# Altium schematic sheet main.SchDoc
size 127 x 101 mm; SheetNumber: 1; SheetTotal: 9
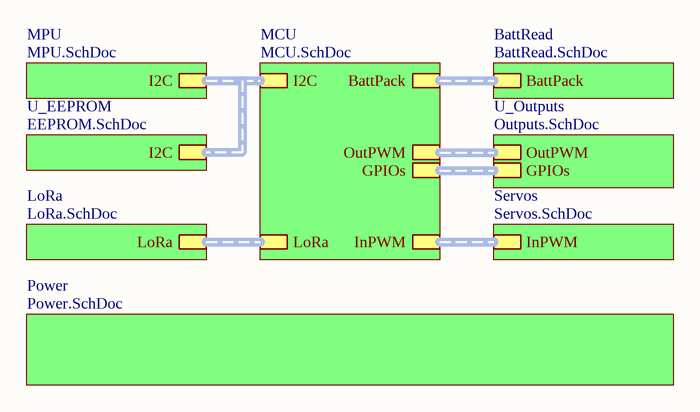
[diagram p0: main.SchDoc]

## Sub-sheets
BattRead = BattRead.SchDoc: BattPack (harness BattPack)
LoRa = LoRa.SchDoc: LoRa (harness LoRa)
MCU = MCU.SchDoc: BattPack (harness BattPack), LoRa (harness LoRa), I2C (harness I2C), InPWM (harness InPWM), OutPWM (harness OutPWM), GPIOs (harness GPIOs)
MPU = MPU.SchDoc: I2C (harness I2C)
Power = Power.SchDoc: no entries
Servos = Servos.SchDoc: InPWM (harness InPWM)
U_EEPROM = EEPROM.SchDoc: I2C (harness I2C)
U_Outputs = Outputs.SchDoc: OutPWM (harness OutPWM), GPIOs (harness GPIOs)

## Buses and harness runs
harness sheet BattRead/BattPack = sheet MCU/BattPack
harness sheet LoRa/LoRa = sheet MCU/LoRa
harness sheet MCU/GPIOs = sheet U_Outputs/GPIOs
harness sheet MCU/I2C = sheet MPU/I2C = sheet U_EEPROM/I2C
harness sheet MCU/InPWM = sheet Servos/InPWM
harness sheet MCU/OutPWM = sheet U_Outputs/OutPWM